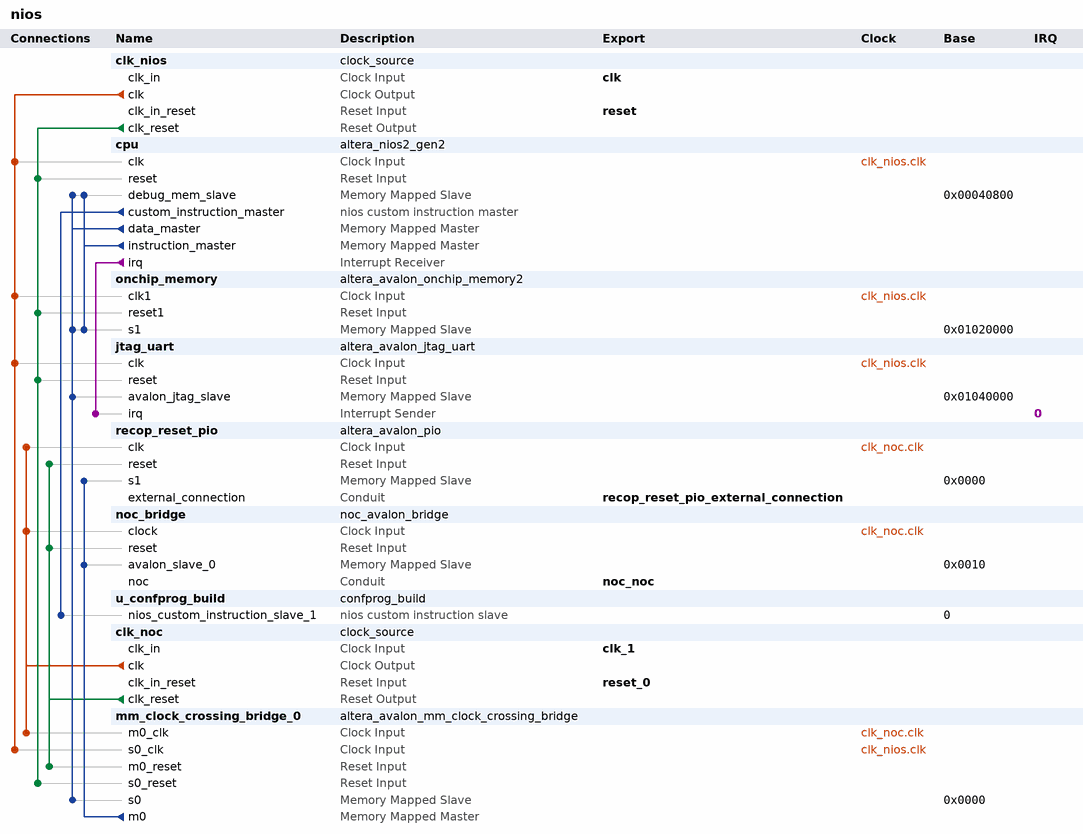
[diagram p0: system contents]
# Platform Designer (Qsys) system nios, Cyclone V 5CSEMA5F31C6
# Parameters at their usual value, and those the tool derives, are not listed.
package require -exact qsys 18.1
create_system nios
set_project_property DEVICE_FAMILY {Cyclone V}
set_project_property DEVICE 5CSEMA5F31C6

add_instance clk_nios clock_source 18.1
set_instance_parameter_value clk_nios clockFrequency 50000000

add_instance cpu altera_nios2_gen2 18.1
set_instance_parameter_value cpu dcache_size 0
set_instance_parameter_value cpu exceptionSlave onchip_memory.s1
set_instance_parameter_value cpu icache_size 0
set_instance_parameter_value cpu impl Fast
set_instance_parameter_value cpu resetSlave onchip_memory.s1
set_instance_parameter_value cpu setting_branchpredictiontype Static

add_instance onchip_memory altera_avalon_onchip_memory2 18.1
set_instance_parameter_value onchip_memory dataWidth 32
set_instance_parameter_value onchip_memory dualPort false
set_instance_parameter_value onchip_memory initMemContent true
set_instance_parameter_value onchip_memory initializationFileName onchip_mem.hex
set_instance_parameter_value onchip_memory memorySize 131072

add_instance jtag_uart altera_avalon_jtag_uart 18.1
set_instance_parameter_value jtag_uart simInteractiveOptions NO_INTERACTIVE_WINDOWS

add_instance recop_reset_pio altera_avalon_pio 18.1
set_instance_parameter_value recop_reset_pio direction Output
set_instance_parameter_value recop_reset_pio width 1

add_instance noc_bridge noc_avalon_bridge 1.0

add_instance u_confprog_build confprog_build 1.0

add_instance clk_noc clock_source 18.1
set_instance_parameter_value clk_noc clockFrequency 10000000

add_instance mm_clock_crossing_bridge_0 altera_avalon_mm_clock_crossing_bridge 18.1
set_instance_parameter_value mm_clock_crossing_bridge_0 ADDRESS_WIDTH 10
set_instance_parameter_value mm_clock_crossing_bridge_0 COMMAND_FIFO_DEPTH 4
set_instance_parameter_value mm_clock_crossing_bridge_0 DATA_WIDTH 32
set_instance_parameter_value mm_clock_crossing_bridge_0 MASTER_SYNC_DEPTH 2
set_instance_parameter_value mm_clock_crossing_bridge_0 MAX_BURST_SIZE 1
set_instance_parameter_value mm_clock_crossing_bridge_0 RESPONSE_FIFO_DEPTH 4
set_instance_parameter_value mm_clock_crossing_bridge_0 SLAVE_SYNC_DEPTH 2
set_instance_parameter_value mm_clock_crossing_bridge_0 USE_AUTO_ADDRESS_WIDTH 0

# connections
add_connection clk_nios.clk cpu.clk clock
add_connection clk_nios.clk jtag_uart.clk clock
add_connection clk_nios.clk mm_clock_crossing_bridge_0.s0_clk clock
add_connection clk_nios.clk onchip_memory.clk1 clock
add_connection clk_noc.clk mm_clock_crossing_bridge_0.m0_clk clock
add_connection clk_noc.clk noc_bridge.clock clock
add_connection clk_noc.clk recop_reset_pio.clk clock
add_connection clk_nios.clk_reset cpu.reset reset
add_connection clk_nios.clk_reset jtag_uart.reset reset
add_connection clk_nios.clk_reset mm_clock_crossing_bridge_0.s0_reset reset
add_connection clk_nios.clk_reset onchip_memory.reset1 reset
add_connection clk_noc.clk_reset mm_clock_crossing_bridge_0.m0_reset reset
add_connection clk_noc.clk_reset noc_bridge.reset reset
add_connection clk_noc.clk_reset recop_reset_pio.reset reset
add_connection cpu.data_master cpu.debug_mem_slave avalon
set_connection_parameter_value cpu.data_master/cpu.debug_mem_slave baseAddress 0x00040800
add_connection cpu.data_master jtag_uart.avalon_jtag_slave avalon
set_connection_parameter_value cpu.data_master/jtag_uart.avalon_jtag_slave baseAddress 0x01040000
add_connection cpu.data_master mm_clock_crossing_bridge_0.s0 avalon
set_connection_parameter_value cpu.data_master/mm_clock_crossing_bridge_0.s0 baseAddress 0x0000
add_connection cpu.data_master onchip_memory.s1 avalon
set_connection_parameter_value cpu.data_master/onchip_memory.s1 baseAddress 0x01020000
add_connection cpu.instruction_master cpu.debug_mem_slave avalon
set_connection_parameter_value cpu.instruction_master/cpu.debug_mem_slave baseAddress 0x00040800
add_connection cpu.instruction_master onchip_memory.s1 avalon
set_connection_parameter_value cpu.instruction_master/onchip_memory.s1 baseAddress 0x01020000
add_connection mm_clock_crossing_bridge_0.m0 noc_bridge.avalon_slave_0 avalon
set_connection_parameter_value mm_clock_crossing_bridge_0.m0/noc_bridge.avalon_slave_0 baseAddress 0x0010
add_connection mm_clock_crossing_bridge_0.m0 recop_reset_pio.s1 avalon
set_connection_parameter_value mm_clock_crossing_bridge_0.m0/recop_reset_pio.s1 baseAddress 0x0000
add_connection cpu.irq jtag_uart.irq interrupt
set_connection_parameter_value cpu.irq/jtag_uart.irq irqNumber 0
add_connection cpu.custom_instruction_master u_confprog_build.nios_custom_instruction_slave_1 nios_custom_instruction
set_connection_parameter_value cpu.custom_instruction_master/u_confprog_build.nios_custom_instruction_slave_1 CIName u_confprog_build
set_connection_parameter_value cpu.custom_instruction_master/u_confprog_build.nios_custom_instruction_slave_1 baseAddress 0

# exported interfaces
add_interface clk clock sink
set_interface_property clk EXPORT_OF clk_nios.clk_in
add_interface clk_1 clock sink
set_interface_property clk_1 EXPORT_OF clk_noc.clk_in
add_interface noc_noc conduit end
set_interface_property noc_noc EXPORT_OF noc_bridge.noc
add_interface recop_reset_pio_external_connection conduit end
set_interface_property recop_reset_pio_external_connection EXPORT_OF recop_reset_pio.external_connection
add_interface reset reset sink
set_interface_property reset EXPORT_OF clk_nios.clk_in_reset
add_interface reset_0 reset sink
set_interface_property reset_0 EXPORT_OF clk_noc.clk_in_reset

set_interconnect_requirement {$system} qsys_mm.clockCrossingAdapter HANDSHAKE
set_interconnect_requirement {$system} qsys_mm.enableEccProtection FALSE
set_interconnect_requirement {$system} qsys_mm.insertDefaultSlave FALSE
set_interconnect_requirement {$system} qsys_mm.maxAdditionalLatency 1

save_system nios.qsys
